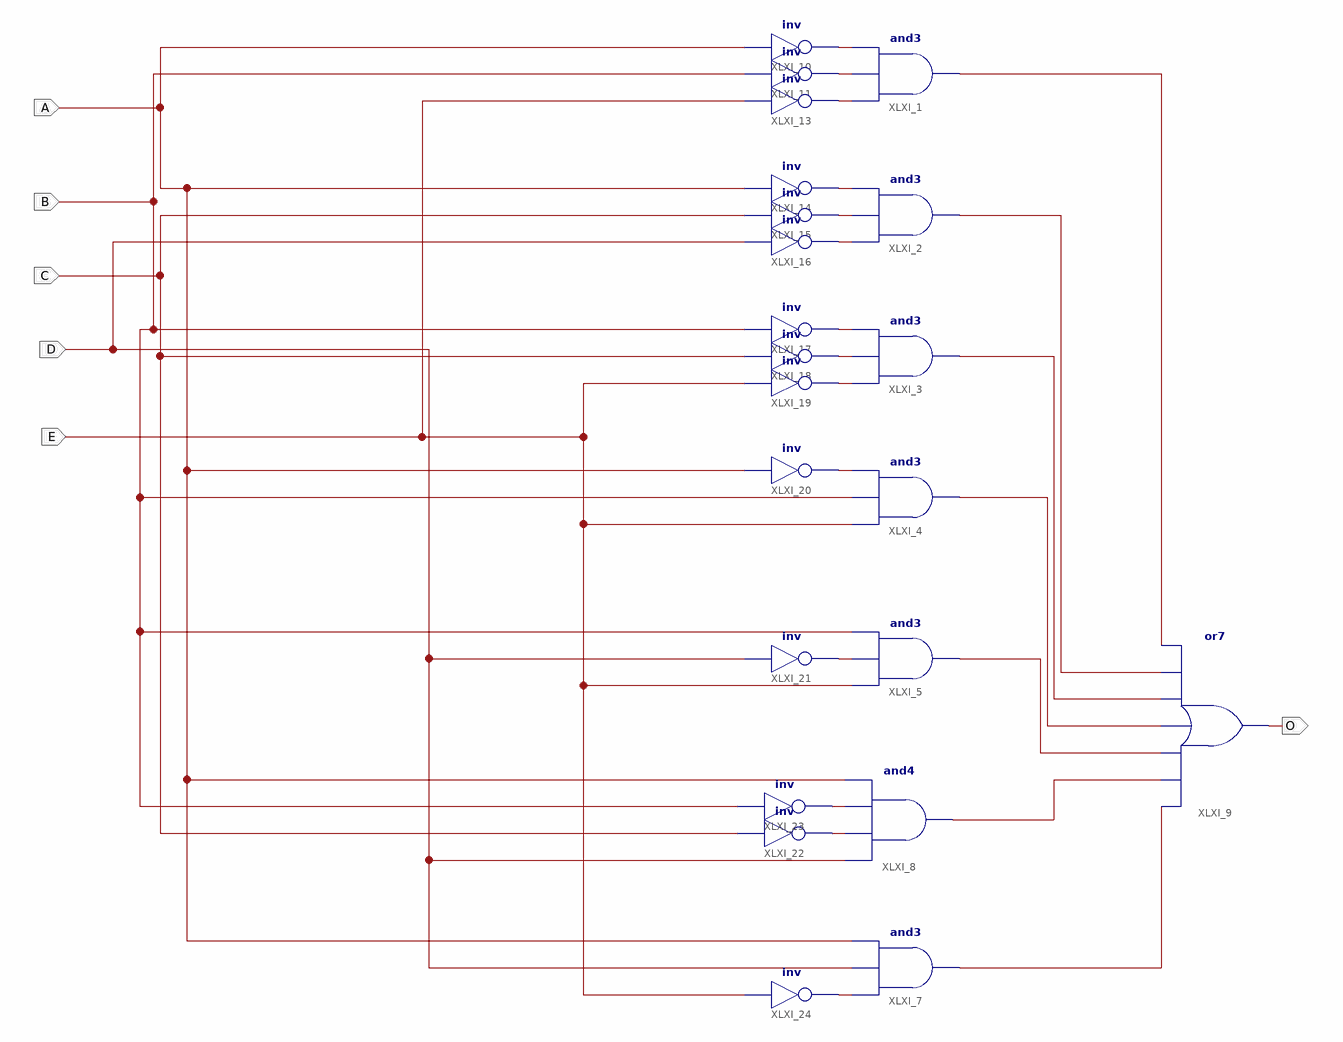
[diagram p0: schematic sheet 1]
// Xilinx ISE schematic curcuit.sch (spartan6) as structural Verilog: 22 symbols, 6 ports
module curcuit (
  input  A,
  input  B,
  input  C,
  input  D,
  input  E,
  output O
);

  wire XLXN_6, XLXN_7, XLXN_8, XLXN_9, XLXN_10, XLXN_11, XLXN_12, XLXN_13, XLXN_14, XLXN_15, XLXN_16,
       XLXN_17, XLXN_18, XLXN_19, XLXN_35, XLXN_36, XLXN_37, XLXN_39, XLXN_40, XLXN_41, XLXN_42;

  and XLXI_1 (XLXN_35, XLXN_8, XLXN_7, XLXN_6);
  and XLXI_2 (XLXN_36, XLXN_11, XLXN_10, XLXN_9);
  and XLXI_3 (XLXN_37, XLXN_14, XLXN_13, XLXN_12);
  and XLXI_4 (XLXN_39, E, B, XLXN_15);
  and XLXI_5 (XLXN_40, E, XLXN_16, B);
  and XLXI_7 (XLXN_42, XLXN_19, D, A);
  and XLXI_8 (XLXN_41, D, XLXN_17, XLXN_18, A);
  or XLXI_9 (O, XLXN_42, XLXN_41, XLXN_40, XLXN_39, XLXN_37, XLXN_36, XLXN_35);
  not XLXI_10 (XLXN_6, A);
  not XLXI_11 (XLXN_7, B);
  not XLXI_13 (XLXN_8, E);
  not XLXI_14 (XLXN_9, A);
  not XLXI_15 (XLXN_10, C);
  not XLXI_16 (XLXN_11, D);
  not XLXI_17 (XLXN_12, B);
  not XLXI_18 (XLXN_13, C);
  not XLXI_19 (XLXN_14, E);
  not XLXI_20 (XLXN_15, A);
  not XLXI_21 (XLXN_16, D);
  not XLXI_22 (XLXN_17, C);
  not XLXI_23 (XLXN_18, B);
  not XLXI_24 (XLXN_19, E);
endmodule
